# EAGLE board BeagleBone_Blue (EAGLE 8.0.1), part 1 of 3
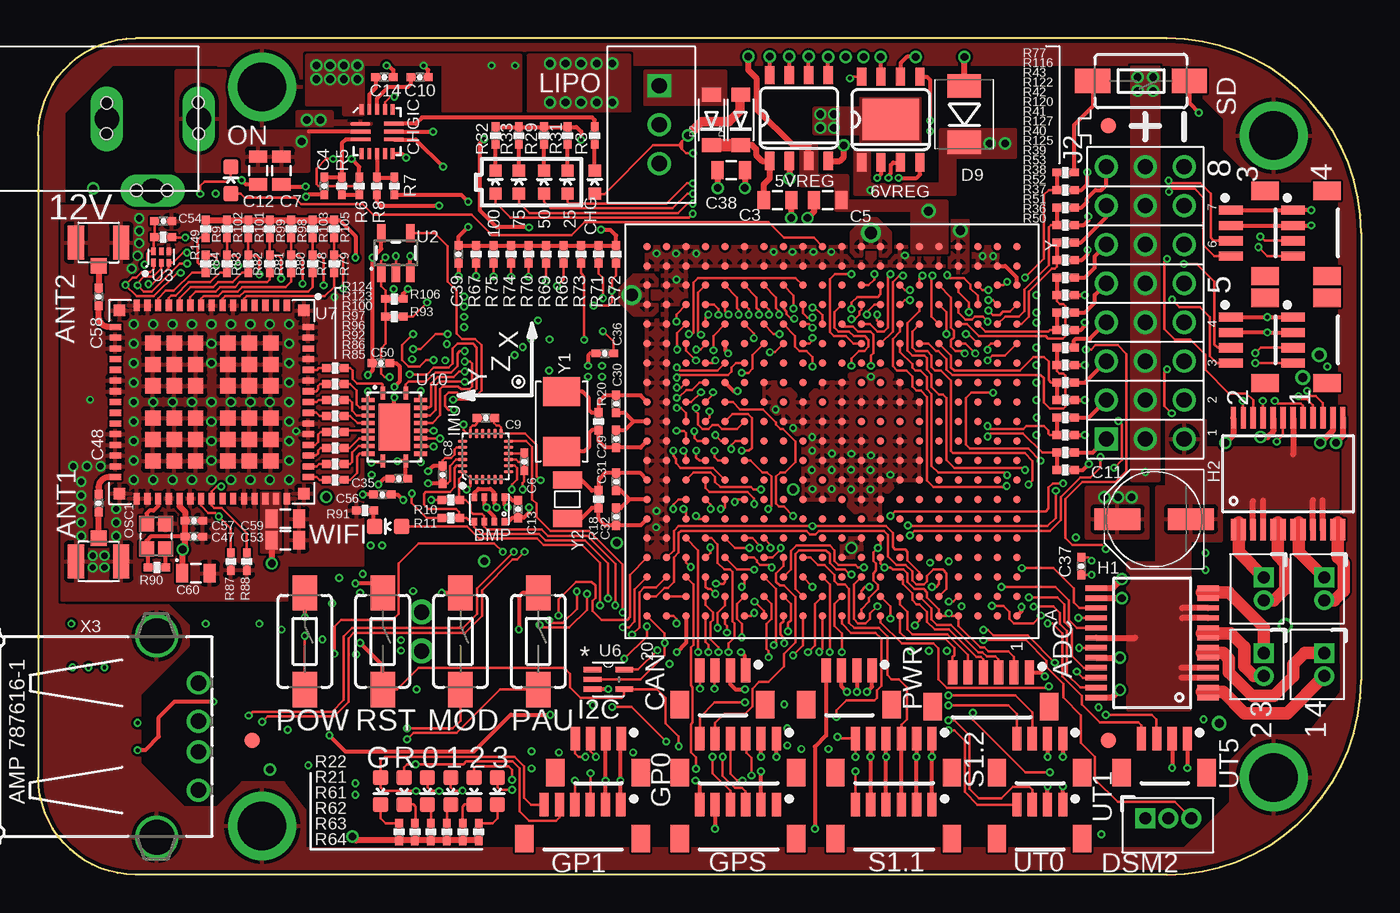
[diagram p5: board, top side]
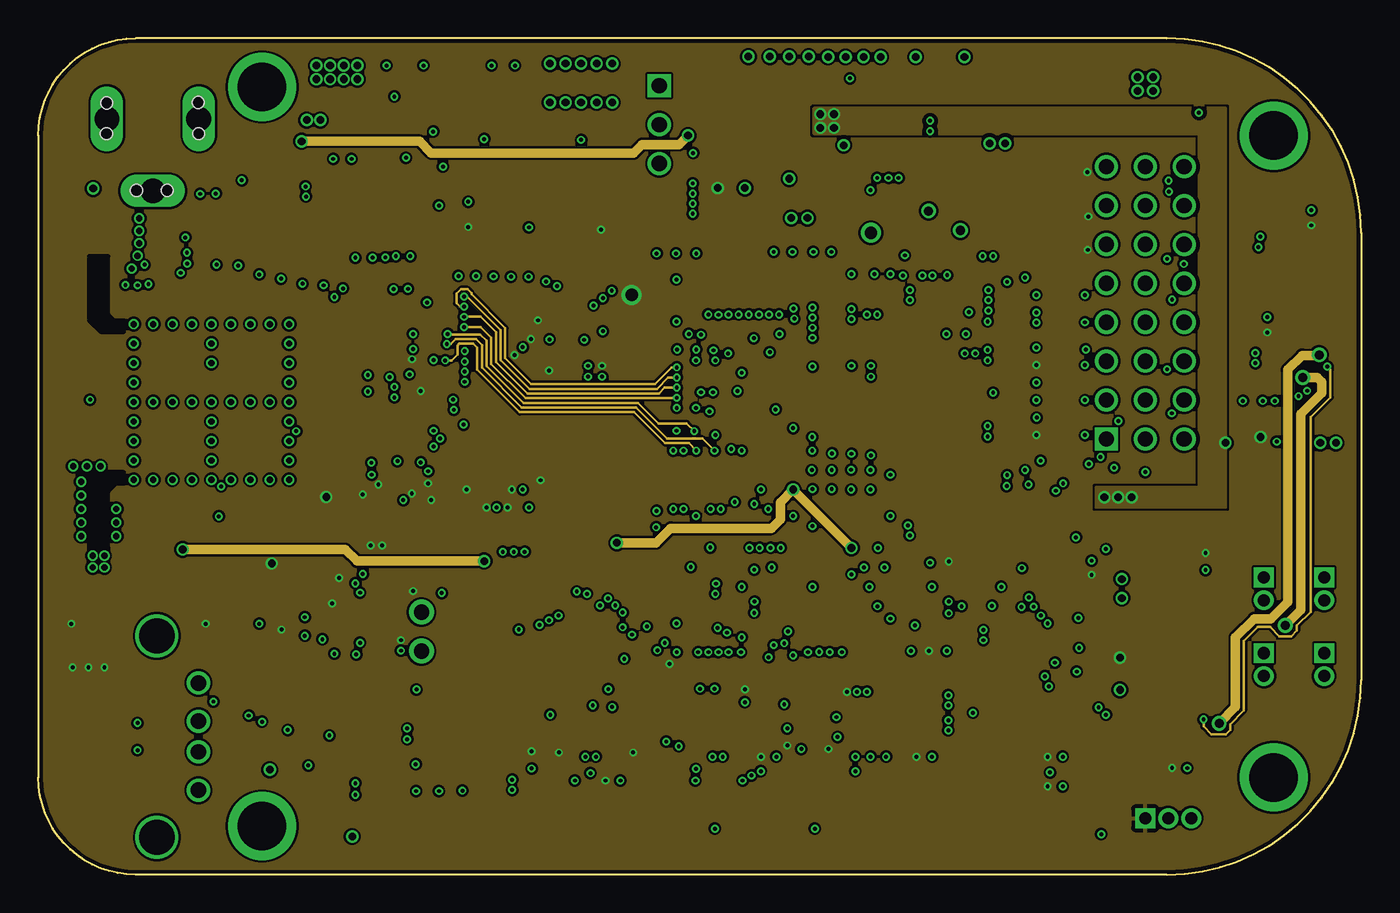
[diagram p6: board, inner layer Route2]
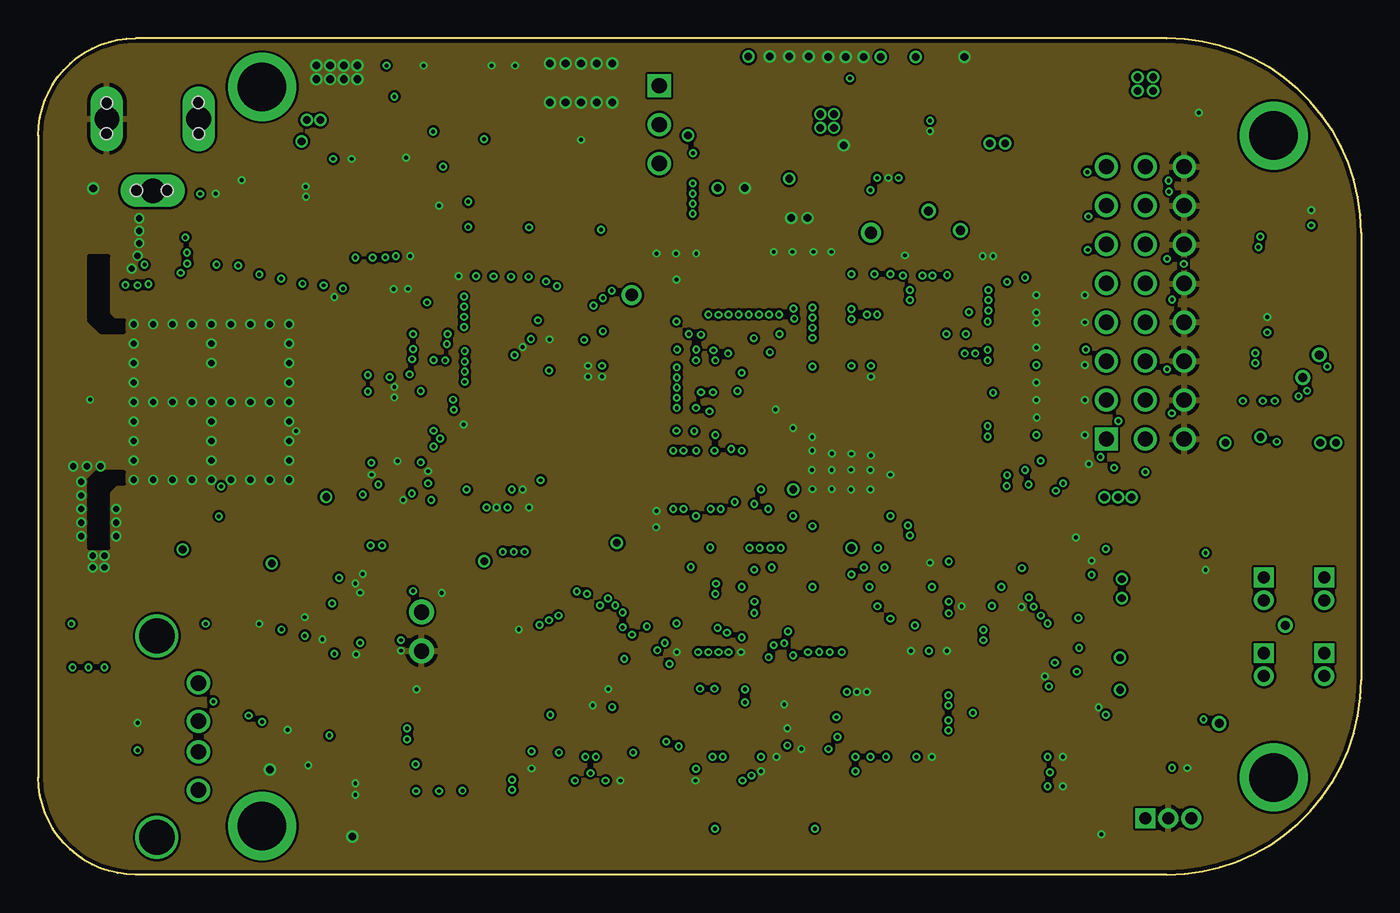
[diagram p7: board, inner layer Route15]
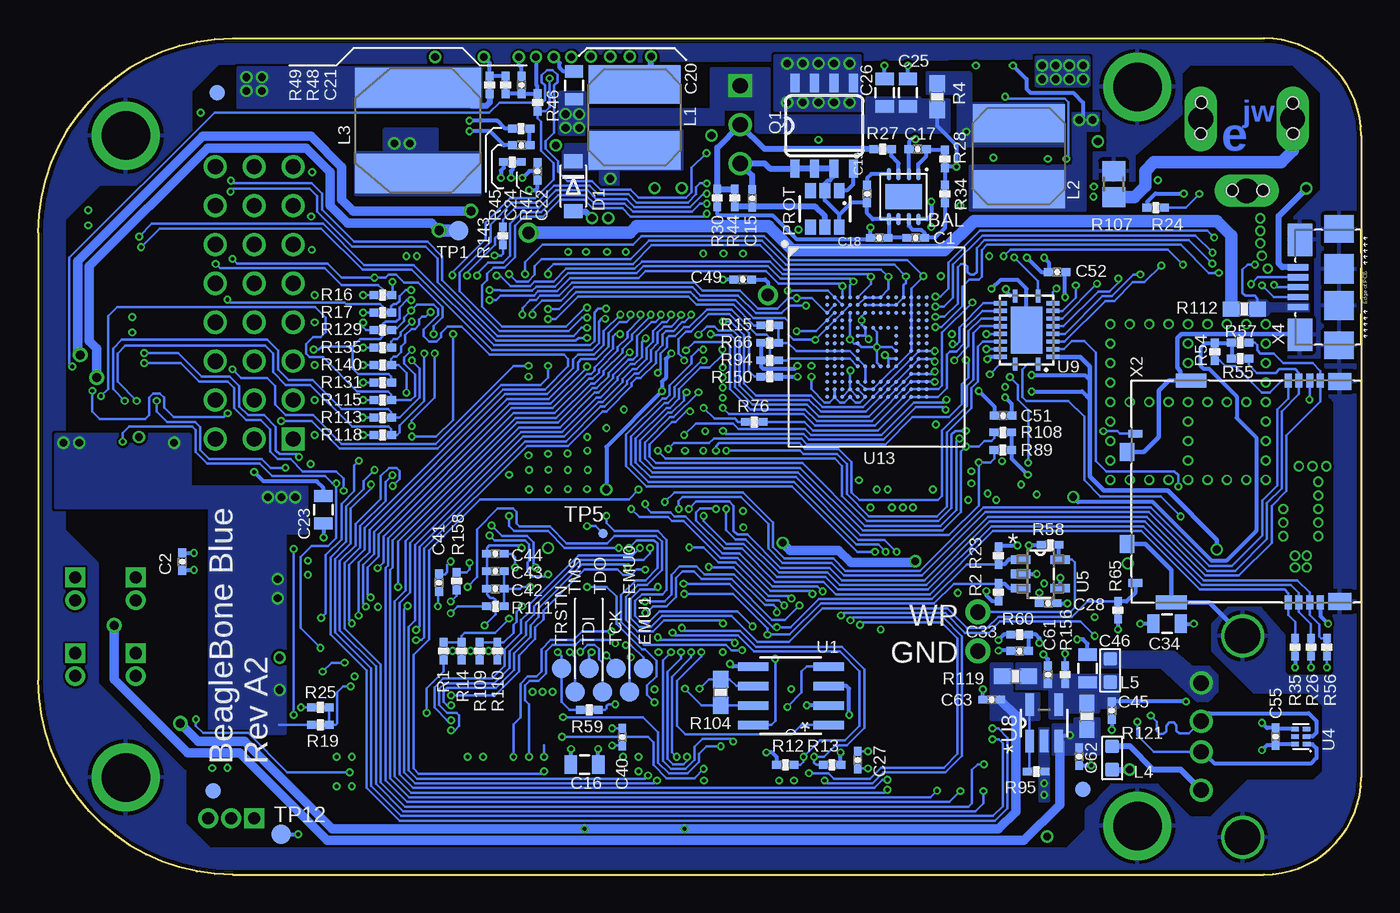
[diagram p8: board, bottom side, seen from below]

Size 86.36 x 54.61 mm. Coordinates in mm from the lower left corner, seen from the top.
Copper layers (1+2*15+16): Top 0.0178mm / dielectric 12mil / Route2 0.0356mm / dielectric 28mil / Route15 0.0356mm / dielectric 12mil / Bottom 0.0178mm
Design rules "SSC-EAGLE-4Lyr_v1.0.0.3 *": minimum track width 6mil, minimum drill 10mil, track to track 6mil, track to pad 6mil, pad to pad 6mil, via to via 6mil, smd to smd 6mil, copper to edge 10mil, drill to drill 8mil, minimum pad ring 10mil, minimum via ring 5mil, stop-mask expansion 3mil, vias tented up to drill 40mil, thermal gap 10mil
Net classes: 0 default: width 0.152 mm, drill 0.254 mm, clearance 0.152 mm; 1 ground: width 0.152 mm, drill 0.254 mm, clearance 0.152 mm; 2 usb: width 0.152 mm, drill 0.254 mm, clearance 0.152 mm; 3 power: width 0.152 mm, drill 0.254 mm, clearance 0.152 mm

## Footprints (pad centres in the part's own frame; a part is rotated, then mirrored left to right if it is on the bottom)
BEAGLEBONE_BLUE_LED-0603 = smd 1 x 1: A 0,-0.877; C 0,0.877
BEAGLEBONE_BLUE_SO08-TIGHT = smd 0.6 x 1.2: 1 -1.905,-2.8; 2 -0.635,-2.8; 3 0.635,-2.8; 4 1.905,-2.8; 5 1.905,2.8; 6 0.635,2.8; 7 -0.635,2.8; 8 -1.905,2.8
SO08-EXPOSED = smd 0.6 x 1.2: 1 -1.905,-2.8; 2 -0.635,-2.8; 3 0.635,-2.8; 4 1.905,-2.8; 5 1.905,2.8; 6 0.635,2.8; 7 -0.635,2.8; 8 -1.905,2.8 | smd 3.683 x 2.718: 9 0,0
PJ-102B_POWER_CON = drill 1.6 long: IN -6,0; OUT 0,0; OUT_CON -3,4.7 | hole 0.762: 0,-1.041; 0.025,0.965; -5.994,0.965; -5.969,-1.067; -1.93,4.674; -3.937,4.674
JST_SH_6 = smd 0.6 x 1.55: 1 5,0; 2 4,0; 3 3,0; 4 2,0; 5 1,0; 6 0,0 | smd 1.2 x 1.8: P$1 -1.3,-2.225; P$2 6.3,-2.225
U.FL-R-SMT-1 = smd 1.05 x 2.2: GND1 -1.475,0; GND2 1.475,0 | smd 1.05 x 1: SIG 0,-1.525
LED-0603 = smd 0.8 x 0.8: A 0,-0.75; C 0,0.75
8-SON_3X3MM = smd 0.305 x 0.813: 1 -0.965,-1.473; 2 -0.33,-1.473; 3 0.33,-1.473; 4 0.965,-1.473; 5 0.965,1.473; 6 0.33,1.473; 7 -0.33,1.473 | smd 0.305 x 0.787: 8 -0.965,1.473 | smd 2.4 x 1.651: PAD 0,0
BMP280 = smd 0.5 x 0.35: 1 0.8,0.975; 2 0.8,0.325; 3 0.8,-0.325; 4 0.8,-0.975; 5 -0.8,-0.975; 6 -0.8,-0.325; 7 -0.8,0.325; 8 -0.8,0.975
0402-CAP = smd 0.61 x 0.508: 1 -0.559,0; 2 0.559,0
0805 = smd 0.8 x 1.2: 1 -0.9,0; 2 0.9,0
PANASONIC_D = smd 3 x 1.4: + 2.4,0; - -2.4,0
JST_SH_4_SMD = smd 0.6 x 1.55: 1 0.46,1.27; 2 -0.54,1.27; 3 -1.54,1.27; 4 -2.54,1.27 | smd 1.2 x 1.8: P$1 -3.84,-0.955; P$2 1.728,-0.955
MP2615 = smd 1.295 x 0.254: 1 -1.092,0.508; 2 -1.092,0; 3 -1.092,-0.508; 9 1.092,-0.508; 10 1.092,0; 11 1.092,0.508 | smd 0.254 x 0.711: 4 -1.016,-1.448; 5 -0.508,-1.448; 6 0,-1.448; 7 0.508,-1.448; 8 1.016,-1.448; 12 1.016,1.448; 13 0.508,1.448; 14 0,1.448; 15 -0.508,1.448; 16 -1.016,1.448
ADAFRUIT_SOD-123FL = smd 0.91 x 1.22: A 1.637,0; C -1.637,0
DO-214AA = smd 1.524 x 2.184: A 1.841,0; C -1.841,0
JST_ZH_3 = drill 0.787 square: P$1 0,0 | drill 0.787: P$2 1.499,0; P$3 2.997,0
B1,27 = smd 1.27 x 1.27: TP 0,0
FIDUCIAL_40MIL = smd 1.016 x 1.016: P$1 0,0
GHI2_TESTPAD/W_HOLE_1X1 = drill 1 pad 1.626: P$1 0,0
SSOP24 = smd 0.348 x 1.397: 1 -3.575,-3.656; 2 -2.925,-3.656; 3 -2.275,-3.656; 4 -1.625,-3.656; 5 -0.975,-3.656; 6 -0.325,-3.656; 7 0.325,-3.656; 8 0.975,-3.656; 9 1.625,-3.656; 10 2.275,-3.656; 11 2.925,-3.656; 12 3.575,-3.656; 13 3.575,3.656; 14 2.925,3.656; 15 2.275,3.656; 16 1.625,3.656; 17 0.975,3.656; 18 0.325,3.656; 19 -0.325,3.656; 20 -0.975,3.656; 21 -1.625,3.656; 22 -2.275,3.656; 23 -2.925,3.656; 24 -3.575,3.656
QFN24G-0.4-3X3MM = smd 0.6 x 0.2: 1 -1.5,1; 2 -1.5,0.6; 3 -1.5,0.2; 4 -1.5,-0.2; 5 -1.5,-0.6; 6 -1.5,-1; 13 1.5,-1; 14 1.5,-0.6; 15 1.5,-0.2; 16 1.5,0.2; 17 1.5,0.6; 18 1.5,1 | smd 0.2 x 0.6: 7 -1,-1.5; 8 -0.6,-1.5; 9 -0.2,-1.5; 10 0.2,-1.5; 11 0.6,-1.5; 12 1,-1.5; 19 1,1.5; 20 0.6,1.5; 21 0.2,1.5; 22 -0.2,1.5; 23 -0.6,1.5; 24 -1,1.5
STRAWSON_EAGLE_LIB_3X8_0.1"_HEADER = drill 1 square: P$1 -2.54,-17.78 | drill 1: P$2 -2.54,-15.24; P$3 -2.54,-12.7; P$4 -2.54,-10.16; P$5 -2.54,-7.62; P$6 -2.54,-5.08; P$7 0,-17.78; P$8 0,-15.24; P$9 0,-12.7; P$10 0,-10.16; P$11 0,-7.62; P$12 0,-5.08; P$13 2.54,-17.78; P$14 2.54,-15.24; P$15 2.54,-12.7; P$16 2.54,-10.16; P$17 2.54,-7.62; P$18 2.54,-5.08; P$19 -2.54,-2.54; P$20 -2.54,0; P$21 0,-2.54; P$22 0,0; P$23 2.54,-2.54; P$24 2.54,0
SRN6045 = smd 2.5 x 6: 1 -2.175,-0.175; 2 2.125,-0.175
8X8MM_INDUCTOR = smd 2.591 x 8.204: 1 -2.794,0; 2 2.794,0
L0603 = smd 0.889 x 0.889: 1 -0.762,0; 2 0.762,0
JST_XH_3-PIN = drill 1 square: P$1 0,0 | drill 1: P$2 0,-2.54; P$3 0,-5.08
JST_ZH_2 = drill 0.787 pad 1.219 square: P$1 -0.749,0 | drill 0.787 pad 1.219: P$2 0.749,0
MOUNTING_HOLE = drill 3.175 pad 4.445: P$1 0,0
TACTILE-SWITCH-1101NE = smd 2.3 x 1.6: 1 -3.15,0; 2 3.15,0
NZ2520S = smd 1 x 1: 1 -0.825,-0.625; 2 0.825,-0.625; 3 0.825,0.625; 4 -0.825,0.625
SOT-236 = smd 0.991 x 0.711: 1 -1.194,0.94; 2 -1.194,0; 3 -1.194,-0.94; 4 1.194,-0.94; 5 1.194,0; 6 1.194,0.94
SO08-TIGHT = smd 0.6 x 1.2: 1 -1.905,-2.8; 2 -0.635,-2.8; 3 0.635,-2.8; 4 1.905,-2.8; 5 1.905,2.8; 6 0.635,2.8; 7 -0.635,2.8; 8 -1.905,2.8
0402-RES = smd 0.61 x 0.508: 1 -0.559,0; 2 0.559,0
0603-RES = smd 1.1 x 1: 1 -0.85,0; 2 0.85,0
R0805 = smd 1.3 x 1.5: 1 -0.85,0; 2 0.85,0
BEAGLEBONE_BLUE_OSD3358 = smd 0.5 x 0.5: A1 -12.065,-12.065; A2 -12.065,-10.795; A3 -12.065,-9.525; A4 -12.065,-8.255; A5 -12.065,-6.985; A6 -12.065,-5.715; A7 -12.065,-4.445; A8 -12.065,-3.175; A9 -12.065,-1.905; A10 -12.065,-0.635; A11 -12.065,0.635; A12 -12.065,1.905; A13 -12.065,3.175; A14 -12.065,4.445; A15 -12.065,5.715; A16 -12.065,6.985; A17 -12.065,8.255; A18 -12.065,9.525; A19 -12.065,10.795; A20 -12.065,12.065; B1 -10.795,-12.065; B2 -10.795,-10.795; B3 -10.795,-9.525; B4 -10.795,-8.255; B5 -10.795,-6.985; B6 -10.795,-5.715; B7 -10.795,-4.445; B8 -10.795,-3.175; B9 -10.795,-1.905; B10 -10.795,-0.635; B11 -10.795,0.635; B12 -10.795,1.905; B13 -10.795,3.175; B14 -10.795,4.445; B15 -10.795,5.715; B16 -10.795,6.985; B17 -10.795,8.255; B18 -10.795,9.525; B19 -10.795,10.795; B20 -10.795,12.065; C1 -9.525,-12.065; C2 -9.525,-10.795; C3 -9.525,-9.525; C4 -9.525,-8.255; C5 -9.525,-6.985; C6 -9.525,-5.715; C7 -9.525,-4.445; C8 -9.525,-3.175; C9 -9.525,-1.905; C10 -9.525,-0.635; C11 -9.525,0.635; C12 -9.525,1.905; C13 -9.525,3.175; C14 -9.525,4.445; C15 -9.525,5.715; C16 -9.525,6.985; C17 -9.525,8.255; C18 -9.525,9.525; C19 -9.525,10.795; C20 -9.525,12.065; D1 -8.255,-12.065; D2 -8.255,-10.795; D3 -8.255,-9.525; D4 -8.255,-8.255; D5 -8.255,-6.985; D6 -8.255,-5.715; D7 -8.255,-4.445; D8 -8.255,-3.175; D9 -8.255,-1.905; D10 -8.255,-0.635; D11 -8.255,0.635; D12 -8.255,1.905; D13 -8.255,3.175; D14 -8.255,4.445; D15 -8.255,5.715; D16 -8.255,6.985; D17 -8.255,8.255; D18 -8.255,9.525; D19 -8.255,10.795; D20 -8.255,12.065; E1 -6.985,-12.065; E2 -6.985,-10.795; E3 -6.985,-9.525; E4 -6.985,-8.255; E5 -6.985,-6.985; E6 -6.985,-5.715; E7 -6.985,-4.445; E8 -6.985,-3.175; E9 -6.985,-1.905; E10 -6.985,-0.635; E11 -6.985,0.635; E12 -6.985,1.905; E13 -6.985,3.175; E14 -6.985,4.445; E15 -6.985,5.715; E16 -6.985,6.985; E17 -6.985,8.255; E18 -6.985,9.525; E19 -6.985,10.795; E20 -6.985,12.065; F1 -5.715,-12.065; F2 -5.715,-10.795; F3 -5.715,-9.525; F4 -5.715,-8.255; F5 -5.715,-6.985; F6 -5.715,-5.715; F7 -5.715,-4.445; F8 -5.715,-3.175; F9 -5.715,-1.905; F10 -5.715,-0.635; F11 -5.715,0.635; F12 -5.715,1.905; F13 -5.715,3.175; F14 -5.715,4.445; F15 -5.715,5.715; F16 -5.715,6.985; F17 -5.715,8.255; F18 -5.715,9.525; F19 -5.715,10.795; F20 -5.715,12.065; G1 -4.445,-12.065; G2 -4.445,-10.795; G3 -4.445,-9.525; G4 -4.445,-8.255; G5 -4.445,-6.985; G6 -4.445,-5.715; G7 -4.445,-4.445; G8 -4.445,-3.175; G9 -4.445,-1.905; G10 -4.445,-0.635; G11 -4.445,0.635; G12 -4.445,1.905; G13 -4.445,3.175; G14 -4.445,4.445; G15 -4.445,5.715; G16 -4.445,6.985; G17 -4.445,8.255; G18 -4.445,9.525; G19 -4.445,10.795; G20 -4.445,12.065; H1 -3.175,-12.065; H2 -3.175,-10.795; H3 -3.175,-9.525; H4 -3.175,-8.255; H5 -3.175,-6.985; H6 -3.175,-5.715; H7 -3.175,-4.445; H8 -3.175,-3.175; H9 -3.175,-1.905; H10 -3.175,-0.635; H11 -3.175,0.635; H12 -3.175,1.905; H13 -3.175,3.175; H14 -3.175,4.445; H15 -3.175,5.715; H16 -3.175,6.985; H17 -3.175,8.255; H18 -3.175,9.525; H19 -3.175,10.795; H20 -3.175,12.065; J1 -1.905,-12.065; J2 -1.905,-10.795; J3 -1.905,-9.525; J4 -1.905,-8.255; J5 -1.905,-6.985; J6 -1.905,-5.715; J7 -1.905,-4.445; J8 -1.905,-3.175; J9 -1.905,-1.905; J10 -1.905,-0.635; J11 -1.905,0.635; J12 -1.905,1.905; J13 -1.905,3.175; J14 -1.905,4.445; J15 -1.905,5.715; J16 -1.905,6.985; J17 -1.905,8.255; J18 -1.905,9.525; J19 -1.905,10.795; J20 -1.905,12.065; K1 -0.635,-12.065; K2 -0.635,-10.795; K3 -0.635,-9.525; K4 -0.635,-8.255; K5 -0.635,-6.985; K6 -0.635,-5.715; K7 -0.635,-4.445; K8 -0.635,-3.175; K9 -0.635,-1.905; K10 -0.635,-0.635; K11 -0.635,0.635; K12 -0.635,1.905; K13 -0.635,3.175; K14 -0.635,4.445; K15 -0.635,5.715; K16 -0.635,6.985; K17 -0.635,8.255; K18 -0.635,9.525; K19 -0.635,10.795; K20 -0.635,12.065; L1 0.635,-12.065; L2 0.635,-10.795; L3 0.635,-9.525; L4 0.635,-8.255; L5 0.635,-6.985; L6 0.635,-5.715; L7 0.635,-4.445; L8 0.635,-3.175; L9 0.635,-1.905; L10 0.635,-0.635; L11 0.635,0.635; L12 0.635,1.905; L13 0.635,3.175; L14 0.635,4.445; L15 0.635,5.715; L16 0.635,6.985; L17 0.635,8.255; L18 0.635,9.525; L19 0.635,10.795; L20 0.635,12.065; M1 1.905,-12.065; M2 1.905,-10.795; M3 1.905,-9.525; M4 1.905,-8.255; M5 1.905,-6.985; M6 1.905,-5.715; M7 1.905,-4.445; M8 1.905,-3.175; M9 1.905,-1.905; M10 1.905,-0.635; M11 1.905,0.635; M12 1.905,1.905; M13 1.905,3.175; M14 1.905,4.445; M15 1.905,5.715; M16 1.905,6.985; M17 1.905,8.255; M18 1.905,9.525; M19 1.905,10.795; M20 1.905,12.065; N1 3.175,-12.065; N2 3.175,-10.795; N3 3.175,-9.525; N4 3.175,-8.255; N5 3.175,-6.985; N6 3.175,-5.715; N7 3.175,-4.445; N8 3.175,-3.175; N9 3.175,-1.905; N10 3.175,-0.635; N11 3.175,0.635; N12 3.175,1.905; N13 3.175,3.175; N14 3.175,4.445; N15 3.175,5.715; N16 3.175,6.985; N17 3.175,8.255; N18 3.175,9.525; N19 3.175,10.795; N20 3.175,12.065; P1 4.445,-12.065; P2 4.445,-10.795; P3 4.445,-9.525; P4 4.445,-8.255; P5 4.445,-6.985; P6 4.445,-5.715; P7 4.445,-4.445; P8 4.445,-3.175; P9 4.445,-1.905; P10 4.445,-0.635; P11 4.445,0.635; P12 4.445,1.905; P13 4.445,3.175; P14 4.445,4.445; P15 4.445,5.715; P16 4.445,6.985; P17 4.445,8.255; P18 4.445,9.525; P19 4.445,10.795; P20 4.445,12.065; R1 5.715,-12.065; R2 5.715,-10.795; R3 5.715,-9.525; R4 5.715,-8.255; R5 5.715,-6.985; R6 5.715,-5.715; R7 5.715,-4.445; R8 5.715,-3.175; R9 5.715,-1.905; R10 5.715,-0.635; R11 5.715,0.635; R12 5.715,1.905; R13 5.715,3.175; R14 5.715,4.445; R15 5.715,5.715; R16 5.715,6.985; R17 5.715,8.255; R18 5.715,9.525; R19 5.715,10.795; R20 5.715,12.065; T1 6.985,-12.065; T2 6.985,-10.795; T3 6.985,-9.525; T4 6.985,-8.255; T5 6.985,-6.985; T6 6.985,-5.715; T7 6.985,-4.445; T8 6.985,-3.175; T9 6.985,-1.905; T10 6.985,-0.635; T11 6.985,0.635; T12 6.985,1.905; T13 6.985,3.175; T14 6.985,4.445; T15 6.985,5.715; T16 6.985,6.985; T17 6.985,8.255; T18 6.985,9.525; T19 6.985,10.795; T20 6.985,12.065; U1 8.255,-12.065; U2 8.255,-10.795; U3 8.255,-9.525; U4 8.255,-8.255; U5 8.255,-6.985; U6 8.255,-5.715; U7 8.255,-4.445; U8 8.255,-3.175; U9 8.255,-1.905; U10 8.255,-0.635; U11 8.255,0.635; U12 8.255,1.905; U13 8.255,3.175; U14 8.255,4.445; U15 8.255,5.715; U16 8.255,6.985; U17 8.255,8.255; U18 8.255,9.525; U19 8.255,10.795; U20 8.255,12.065; V1 9.525,-12.065; V2 9.525,-10.795; V3 9.525,-9.525; V4 9.525,-8.255; V5 9.525,-6.985; V6 9.525,-5.715; V7 9.525,-4.445; V8 9.525,-3.175; V9 9.525,-1.905; V10 9.525,-0.635; V11 9.525,0.635; V12 9.525,1.905; V13 9.525,3.175; V14 9.525,4.445; V15 9.525,5.715; V16 9.525,6.985; V17 9.525,8.255; V18 9.525,9.525; V19 9.525,10.795; V20 9.525,12.065; W1 10.795,-12.065; W2 10.795,-10.795; W3 10.795,-9.525; W4 10.795,-8.255; W5 10.795,-6.985; W6 10.795,-5.715; W7 10.795,-4.445; W8 10.795,-3.175; W9 10.795,-1.905; W10 10.795,-0.635; W11 10.795,0.635; W12 10.795,1.905; W13 10.795,3.175; W14 10.795,4.445; W15 10.795,5.715; W16 10.795,6.985; W17 10.795,8.255; W18 10.795,9.525; W19 10.795,10.795; W20 10.795,12.065; Y1 12.065,-12.065; Y2 12.065,-10.795; Y3 12.065,-9.525; Y4 12.065,-8.255; Y5 12.065,-6.985; Y6 12.065,-5.715; Y7 12.065,-4.445; Y8 12.065,-3.175; Y9 12.065,-1.905; Y10 12.065,-0.635; Y11 12.065,0.635; Y12 12.065,1.905; Y13 12.065,3.175; Y14 12.065,4.445; Y15 12.065,5.715; Y16 12.065,6.985; Y17 12.065,8.255; Y18 12.065,9.525; Y19 12.065,10.795; Y20 12.065,12.065
BEAGLEBONE_BLUE_B0,65 = smd 0.635 x 0.635: TP 0,0
BEAGLEBONE_BLUE_D8 = smd 1.981 x 0.559: 1 -2.464,1.905; 2 -2.464,0.635; 3 -2.464,-0.635; 4 -2.464,-1.905; 5 2.464,-1.905; 6 2.464,-0.635; 7 2.464,0.635; 8 2.464,1.905
BEAGLEBONE_BLUE_SOT23-5 = smd 0.55 x 1.2: 1 -0.95,-1.3; 2 0,-1.3; 3 0.95,-1.3; 4 0.95,1.3; 5 -0.95,1.3
SON-6(TI)-DRY = smd 0.3 x 0.52: 1 -0.5,-0.38 | smd 0.3 x 0.49: 2 0,-0.375; 3 0.5,-0.375; 4 0.5,0.375; 5 0,0.375; 6 -0.5,0.375
SOT95P290X145-5N = smd 1.27 x 0.559: 1 -1.295,0.94; 2 -1.295,0; 3 -1.295,-0.94; 4 1.295,-0.94; 5 1.295,0.94
BEAGLEBONE_BLUE_DCK5 = smd 1.168 x 0.356: 1 -1.041,0.65; 2 -1.041,0; 3 -1.041,-0.65; 4 1.041,-0.65; 5 1.041,0.65
MOC-100(TI) = smd 0.75 x 0.75: 1 -6.025,-5.975; 17 6.025,-5.975; 33 6.025,5.975; 49 -6.025,5.975 | smd 0.4 x 0.75: 2 -4.9,-6.3; 3 -4.2,-6.3; 4 -3.5,-6.3; 5 -2.8,-6.3; 6 -2.1,-6.3; 7 -1.4,-6.3; 8 -0.7,-6.3; 9 0,-6.3; 10 0.7,-6.3; 11 1.4,-6.3; 12 2.1,-6.3; 13 2.8,-6.3; 14 3.5,-6.3; 15 4.2,-6.3; 16 4.9,-6.3; 34 4.9,6.3; 35 4.2,6.3; 36 3.5,6.3; 37 2.8,6.3; 38 2.1,6.3; 39 1.4,6.3; 40 0.7,6.3; 41 0,6.3; 42 -0.7,6.3; 43 -1.4,6.3; 44 -2.1,6.3; 45 -2.8,6.3; 46 -3.5,6.3; 47 -4.2,6.3; 48 -4.9,6.3 | smd 0.75 x 0.4: 18 6.3,-4.9; 19 6.3,-4.2; 20 6.3,-3.5; 21 6.3,-2.8; 22 6.3,-2.1; 23 6.3,-1.4; 24 6.3,-0.7; 25 6.3,0; 26 6.3,0.7; 27 6.3,1.4; 28 6.3,2.1; 29 6.3,2.8; 30 6.3,3.5; 31 6.3,4.2; 32 6.3,4.9; 50 -6.3,4.9; 51 -6.3,4.2; 52 -6.3,3.5; 53 -6.3,2.8; 54 -6.3,2.1; 55 -6.3,1.4; 56 -6.3,0.7; 57 -6.3,0; 58 -6.3,-0.7; 59 -6.3,-1.4; 60 -6.3,-2.1; 61 -6.3,-2.8; 62 -6.3,-3.5; 63 -6.3,-4.2; 64 -6.3,-4.9 | smd 1 x 1: G1 -3.85,-3.85; G2 -2.45,-3.85; G3 -1.05,-3.85; G4 1.05,-3.85; G5 2.45,-3.85; G6 3.85,-3.85; G7 -3.85,-2.45; G8 -2.45,-2.45; G9 -1.05,-2.45; G10 1.05,-2.45; G11 2.45,-2.45; G12 3.85,-2.45; G13 -3.85,-1.05; G14 -2.45,-1.05; G15 -1.05,-1.05; G16 1.05,-1.05; G17 2.45,-1.05; G18 3.85,-1.05; G19 -3.85,1.05; G20 -2.45,1.05; G21 -1.05,1.05; G22 1.05,1.05; G23 2.45,1.05; G24 3.85,1.05; G25 -3.85,2.45; G26 -2.45,2.45; G27 -1.05,2.45; G28 1.05,2.45; G29 2.45,2.45; G30 3.85,2.45; G31 -3.85,3.85; G32 -2.45,3.85; G33 -1.05,3.85; G34 1.05,3.85; G35 2.45,3.85; G36 3.85,3.85
DBV5 = smd 1.473 x 0.559: 1 -1.194,0.95; 2 -1.194,0; 3 -1.194,-0.95; 4 1.194,-0.95; 5 1.194,0.95
R-PVQFN-N20(TI) = smd 0.85 x 0.28: 1 -2.225,-0.75; 10 2.225,-0.75; 11 2.225,0.75; 20 -2.225,0.75 | smd 0.28 x 0.85: 2 -1.75,-1.725; 3 -1.25,-1.725; 4 -0.75,-1.725; 5 -0.25,-1.725; 6 0.25,-1.725; 7 0.75,-1.725; 8 1.25,-1.725; 9 1.75,-1.725; 12 1.75,1.725; 13 1.25,1.725; 14 0.75,1.725; 15 0.25,1.725; 16 -0.25,1.725; 17 -0.75,1.725; 18 -1.25,1.725; 19 -1.75,1.725 | smd 3.05 x 2.05: TP 0,0
MICRON_EMMC_153 = smd 0.245 x 0.245: A1 -3.25,3.25; A2 -2.75,3.25; A3 -2.25,3.25; A4 -1.75,3.25; A5 -1.25,3.25; A6 -0.75,3.25; A7 -0.25,3.25; A8 0.25,3.25; A9 0.75,3.25; A10 1.25,3.25; A11 1.75,3.25; A12 2.25,3.25; A13 2.75,3.25; A14 3.25,3.25; B1 -3.25,2.75; B2 -2.75,2.75; B3 -2.25,2.75; B4 -1.75,2.75; B5 -1.25,2.75; B6 -0.75,2.75; B7 -0.25,2.75; B8 0.25,2.75; B9 0.75,2.75; B10 1.25,2.75; B11 1.75,2.75; B12 2.25,2.75; B13 2.75,2.75; B14 3.25,2.75; C1 -3.25,2.25; C2 -2.75,2.25; C3 -2.25,2.25; C4 -1.75,2.25; C5 -1.25,2.25; C6 -0.75,2.25; C7 -0.25,2.25; C8 0.25,2.25; C9 0.75,2.25; C10 1.25,2.25; C11 1.75,2.25; C12 2.25,2.25; C13 2.75,2.25; C14 3.25,2.25; D1 -3.25,1.75; D2 -2.75,1.75; D3 -2.25,1.75; D4 -1.75,1.75; D12 2.25,1.75; D13 2.75,1.75; D14 3.25,1.75; E1 -3.25,1.25; E2 -2.75,1.25; E3 -2.25,1.25; E5 -1.25,1.25; E6 -0.75,1.25; E7 -0.25,1.25; E8 0.25,1.25; E9 0.75,1.25; E10 1.25,1.25; E12 2.25,1.25; E13 2.75,1.25; E14 3.25,1.25; F1 -3.25,0.75; F2 -2.75,0.75; F3 -2.25,0.75; F5 -1.25,0.75; F10 1.25,0.75; F12 2.25,0.75; F13 2.75,0.75; F14 3.25,0.75; G1 -3.25,0.25; G2 -2.75,0.25; G3 -2.25,0.25; G5 -1.25,0.25; G10 1.25,0.25; G12 2.25,0.25; G13 2.75,0.25; G14 3.25,0.25; H1 -3.25,-0.25; H2 -2.75,-0.25; H3 -2.25,-0.25; H5 -1.25,-0.25; H10 1.25,-0.25; H12 2.25,-0.25; H13 2.75,-0.25; H14 3.25,-0.25; J1 -3.25,-0.75; J2 -2.75,-0.75; J3 -2.25,-0.75; J5 -1.25,-0.75; J10 1.25,-0.75; J12 2.25,-0.75; J13 2.75,-0.75; J14 3.25,-0.75; K1 -3.25,-1.25; K2 -2.75,-1.25; K3 -2.25,-1.25; K5 -1.25,-1.25; K6 -0.75,-1.25; K7 -0.25,-1.25; K8 0.25,-1.25; K9 0.75,-1.25; K10 1.25,-1.25; K12 2.25,-1.25; K13 2.75,-1.25; K14 3.25,-1.25; L1 -3.25,-1.75; L2 -2.75,-1.75; L3 -2.25,-1.75; L12 2.25,-1.75; L13 2.75,-1.75; L14 3.25,-1.75; M1 -3.25,-2.25; M2 -2.75,-2.25; M3 -2.25,-2.25; M4 -1.75,-2.25; M5 -1.25,-2.25; M6 -0.75,-2.25; M7 -0.25,-2.25; M8 0.25,-2.25; M9 0.75,-2.25; M10 1.25,-2.25; M11 1.75,-2.25; M12 2.25,-2.25; M13 2.75,-2.25; M14 3.25,-2.25; N1 -3.25,-2.75; N2 -2.75,-2.75; N3 -2.25,-2.75; N4 -1.75,-2.75; N5 -1.25,-2.75; N6 -0.75,-2.75; N7 -0.25,-2.75; N8 0.25,-2.75; N9 0.75,-2.75; N10 1.25,-2.75; N11 1.75,-2.75; N12 2.25,-2.75; N13 2.75,-2.75; N14 3.25,-2.75; P1 -3.25,-3.25; P2 -2.75,-3.25; P3 -2.25,-3.25; P4 -1.75,-3.25; P5 -1.25,-3.25; P6 -0.75,-3.25; P7 -0.25,-3.25; P8 0.25,-3.25; P9 0.75,-3.25; P10 1.25,-3.25; P11 1.75,-3.25; P12 2.25,-3.25; P13 2.75,-3.25; P14 3.25,-3.25
SCHA5B0200 = smd 0.9 x 0.45: 1 -7.25,3.365; 2 -7.25,2.665; 3 -7.25,1.965; 4 -7.25,1.265; 5 7.25,1.265; 6 7.25,1.965; 7 7.25,2.665; 8 7.25,3.365 | smd 0.5 x 0.9: CD -5.975,13.35; GND 3.775,13.35 | smd 0.9 x 2: CGND1 -7.25,11; CGND4 7.25,9.7 | smd 1.1 x 1.5: CGND2 -7.188,0; CGND3 7.188,0 | smd 1.2 x 0.95: CGND5 2.575,13.9; CGND6 -3.425,13.9
USB_HOST_HORIZONTAL_W/CHASSIS_GND = drill 1: 1 -3.5,12.99; 2 -1,12.99; 3 1,12.99; 4 3.5,12.99 | drill 2.3: 5 -6.57,10.28; 6 6.57,10.28
10118192-0001LF(MICRO-USB-B-AMPHENOL-FCI) = smd 1.8 x 1.9: CGND1 -3.8,0; CGND4 3.8,0 | smd 1.9 x 1.9: CGND2 -1.2,0; CGND3 1.2,0 | smd 2.1 x 1.6: CGND5 3.1,2.55; CGND6 -3.1,2.55 | smd 0.4 x 1.35: D+ 0,2.675; D- -0.65,2.675; GND 1.3,2.675; ID 0.65,2.675; VBUS -1.3,2.675
CRYSTAL_5X3.2MM = smd 1.9 x 2.4: 1 -1.95,0; 2 1.95,0
CRYSTAL_3.2X1.5 = smd 1.1 x 1.9: P$1 -1.25,0; P$2 1.25,0

## Placement (x,y rotation side)
0  BLUE  [BEAGLEBONE_BLUE_LED-0603]  25.4,5.46 180 top
1  BLUE  [BEAGLEBONE_BLUE_LED-0603]  26.92,5.46 180 top
2  BLUE  [BEAGLEBONE_BLUE_LED-0603]  28.45,5.46 180 top
3  BLUE  [BEAGLEBONE_BLUE_LED-0603]  29.97,5.46 180 top
5VREG  AP1509SOIC-8-TIGHT  [BEAGLEBONE_BLUE_SO08-TIGHT]  49.66,49.4 0 top
6VREG  AOZ1284  [SO08-EXPOSED]  55.65,49.3 0 top
12V  PJ-102B_POWER_CON  [PJ-102B_POWER_CON]  4.47,49.35 180 top
ADC  JST_SH_6  [JST_SH_6]  59.69,13.21 0 top
ANT1  U.FL-R-SMT-1(10)  [U.FL-R-SMT-1]  3.94,20.45 180 top
ANT2  U.FL-R-SMT-1(10)  [U.FL-R-SMT-1]  3.94,41.27 0 top
B0  RED  [LED-0603]  34.54,45.21 0 top
B1  GREEN  [LED-0603]  33.02,45.21 0 top
B2  GREEN  [LED-0603]  31.37,45.21 0 top
B3  GREEN  [LED-0603]  29.84,45.21 0 top
BAL  BQ29209  [8-SON_3X3MM]  29.87,44.27 180 bottom
BMP  BMP280  [BMP280]  29.44,23.85 270 top
BOARD  [BEAGLEBONE_BLUE_NO_HOLES]  0,54.61 270 top
C1  0.1uF  [0402-CAP]  29.08,41.58 180 bottom
C2  0.1uF  [0402-CAP]  76.96,20.45 90 bottom
C3  10uF  [0805]  48.26,44.04 0 top
C4  1uF  [0402-CAP]  18.67,44.96 90 top
C5  10uF  [0805]  51.54,44.04 180 top
C6  0.1uF  [0402-CAP]  31.72,26.95 270 top
C7  10uF  [0805]  15.88,45.97 270 top
C8  0.1uF  [0402-CAP]  26.39,26.11 90 top
C9  0.1uF  [0402-CAP]  29.21,29.82 0 top
C10  1uF  [0402-CAP]  24.89,52.07 180 top
C11  100uF 16V  [PANASONIC_D]  72.85,23.22 180 top
C12  10uF  [0805]  14.35,45.97 270 top
C13  0.1uF  [0402-CAP]  31.32,23.88 270 top
C14  0.1uF  [0402-CAP]  22.61,52.07 0 top
C15  0.1uF  [0402-CAP]  39.75,44.17 270 bottom
C16  10uF  [0805]  50.7,7.19 0 bottom
C17  0.1uF  [0402-CAP]  28.96,47.37 0 bottom
C18  0.1uF  [0402-CAP]  31.47,41.58 180 bottom
C19  0.1uF  [0402-CAP]  32.26,44.45 270 bottom
C20  10uF  [0805]  51.38,51.54 270 bottom
C21  0.1uF  [0402-CAP]  54.81,51.56 90 bottom
C22  0.1uF  [0402-CAP]  53.77,45.92 270 bottom
C23  10uF  [0805]  67.74,23.83 90 bottom
C24  0.1uF  [0402-CAP]  54.84,47.62 0 bottom
C25  10uF  [0805]  29.59,51.05 90 bottom
C26  10uF  [0805]  31.11,51.05 90 bottom
C27  0.1uF  [0402-CAP]  32.87,7.49 270 bottom
C28  0.1uF  [0402-CAP]  20.45,17.73 180 bottom
C29  10pF  [0402-CAP]  37.72,28.45 90 top
C30  10pF  [0402-CAP]  37.72,30.73 270 top
C31  10pF  [0402-CAP]  37.72,25.65 270 top
C32  10pF  [0402-CAP]  37.72,23.37 270 top
C33  2.2uF  [0402-CAP]  22.3,14.6 180 bottom
C34  10uF  [0805]  12.67,16.38 0 bottom
C35  0.1uF  [0402-CAP]  23.55,25.86 180 top
C36  2.2uF  [0402-CAP]  36.98,34.04 180 top
C37  0.1uF  [0402-CAP]  68.08,20.15 90 top
C38  10uF  [0805]  45.24,46 0 top
C39  0.1uF  [0402-CAP]  27.43,40.51 270 top
C40  0.1uF  [0402-CAP]  48.23,8.99 90 bottom
C41  0.1uF  [0402-CAP]  60.2,19.05 270 bottom
C42  1nF  [0402-CAP]  56.52,18.67 180 bottom
C43  0.1uF  [0402-CAP]  56.52,19.81 180 bottom
C44  0.1uF  [0402-CAP]  56.52,20.95 180 bottom
C45  0.1uF  [0402-CAP]  16.28,10.72 270 bottom
C46  10uF  [0805]  17.87,13.46 90 bottom
C47  0.1uF  [0402-CAP]  10.16,22.07 0 top
C48  10pF  [0402-CAP]  3.94,24.26 90 top
C49  0.1uF  [0402-CAP]  40.36,38.86 0 bottom
C50  0.1uF  [0402-CAP]  22.38,33.4 0 top
C51  0.1uF  [0402-CAP]  23.37,29.97 180 bottom
C52  0.1uF  [0402-CAP]  19.84,39.34 0 bottom
C53  10uF  [0805]  16.13,23.24 0 top
C54  0.1uF  [0402-CAP]  8.15,42.67 0 top
C55  0.1uF  [0402-CAP]  5.59,9.02 90 bottom
C56  0.1uF  [0402-CAP]  22.45,24.82 0 top
C57  1uF  [0402-CAP]  10.16,23.11 180 top
C58  10pF  [0402-CAP]  3.94,37.72 270 top
C59  10uF  [0805]  16.13,21.84 0 top
C60  10uF  [0805]  10.29,19.69 180 top
C61  1uF  [0402-CAP]  20.45,13.06 270 bottom
C62  0.22uF  [0402-CAP]  18.41,7.7 270 bottom
C63  0.22uF  [0402-CAP]  24.13,11.43 180 bottom
CAN  JST_SH_4  [JST_SH_4_SMD]  45.72,12.06 0 top
CHG  GRN  [LED-0603]  36.32,45.21 0 top
CHGIC  MP2615  [MP2615]  22.12,48.51 0 top
D1  [ADAFRUIT_SOD-123FL]  51.44,44.96 270 bottom
D2  [ADAFRUIT_SOD-123FL]  43.94,49.28 90 top
D3  [ADAFRUIT_SOD-123FL]  45.85,49.28 90 top
D9  [DO-214AA]  60.45,49.66 90 top
DSM2  JST_ZH_3  [JST_ZH_3]  72.26,3.68 0 top
E1  JST_SH_4  [JST_SH_4_SMD]  83.19,35.94 90 top
E2  JST_SH_4  [JST_SH_4_SMD]  79.12,35.94 90 top
E3  JST_SH_4  [JST_SH_4_SMD]  79.12,42.93 90 top
E4  JST_SH_4  [JST_SH_4_SMD]  83.19,42.93 90 top
EMU0  TPSQB1,27  [B1,27]  47.75,11.94 0 bottom
EMU1  TPSQB1,27  [B1,27]  46.86,13.46 0 bottom
FUD1  FIDUCIAL  [FIDUCIAL_40MIL]  13.97,8.76 0 top
FUD2  FIDUCIAL  [FIDUCIAL_40MIL]  69.85,8.76 0 top
FUD3  FIDUCIAL  [FIDUCIAL_40MIL]  69.85,48.89 0 top
FUD4  FIDUCIAL  [FIDUCIAL_40MIL]  74.93,5.46 0 bottom
FUD5  FIDUCIAL  [FIDUCIAL_40MIL]  74.68,51.05 0 bottom
FUD6  FIDUCIAL  [FIDUCIAL_40MIL]  18.16,5.59 0 bottom
G  GREEN  [BEAGLEBONE_BLUE_LED-0603]  22.35,5.46 180 top
GND  GHI2_TESTPAD/W_HOLE_1X1  [GHI2_TESTPAD/W_HOLE_1X1]  25.02,14.6 0 bottom
GP0  JST_SH_6  [JST_SH_6]  43.18,8.89 0 top
GP1  JST_SH_6  [JST_SH_6]  33.02,4.57 0 top
GPS  JST_SH_6  [JST_SH_6]  43.18,4.57 0 top
H1  TB6612FNG  [SSOP24]  72.72,15.14 90 top
H2  TB6612FNG  [SSOP24]  81.58,26.17 0 top
I2C  JST_SH_4  [JST_SH_4_SMD]  37.59,7.62 0 top
IMU  MPU-9250  [QFN24G-0.4-3X3MM]  29.21,27.3 90 top
J2  STRAWSON_EAGLE_LIB_SERVO_HEADERS_8X  [STRAWSON_EAGLE_LIB_3X8_0.1"_HEADER]  72.26,46.23 0 top
L1  6.8uH  [SRN6045]  47.6,49.47 90 bottom
L2  6.8uH  [SRN6045]  22.53,46.94 90 bottom
L3  3.6 uH  [8X8MM_INDUCTOR]  61.57,48.59 90 bottom
L4  120  [L0603]  16.26,7.62 90 bottom
L5  120  [L0603]  16.38,13.34 90 bottom
LIPO  BATTERY  [JST_XH_3-PIN]  40.54,51.51 0 top
M1  JST_ZH_2  [JST_ZH_2]  83.95,13.72 270 top
M2  JST_ZH_2  [JST_ZH_2]  80.01,13.72 270 top
M3  JST_ZH_2  [JST_ZH_2]  80.01,18.67 270 top
M4  JST_ZH_2  [JST_ZH_2]  83.95,18.67 270 top
MGT1  MOUNTING_HOLE  [MOUNTING_HOLE]  14.61,51.44 0 top
MGT2  MOUNTING_HOLE  [MOUNTING_HOLE]  80.64,48.26 0 top
MGT3  MOUNTING_HOLE  [MOUNTING_HOLE]  80.64,6.35 0 top
MGT4  MOUNTING_HOLE  [MOUNTING_HOLE]  14.61,3.17 0 top
MOD  SWITCH-MOMENTARY-2SMD-1101NE  [TACTILE-SWITCH-1101NE]  27.56,15.24 270 top
ON  BLUE  [BEAGLEBONE_BLUE_LED-0603]  12.57,45.34 0 top
OSC1  NZ2520SB-32.768KHZ-NSA3534C  [NZ2520S]  7.7,22.1 90 top
PAU  SWITCH-MOMENTARY-2SMD-1101NE  [TACTILE-SWITCH-1101NE]  32.64,15.24 270 top
POW  SWITCH-MOMENTARY-2SMD-1101NE  [TACTILE-SWITCH-1101NE]  17.4,15.24 270 top
PROT  S-8261  [SOT-236]  35.01,43.47 270 bottom
PWR  JST_SH_4  [JST_SH_4_SMD]  53.98,12.06 0 top
Q1  MOSFET-N  [SO08-TIGHT]  35.05,48.89 0 bottom
R  RED  [BEAGLEBONE_BLUE_LED-0603]  23.88,5.46 180 top
R1  47k  [0402-RES]  59.89,14.6 90 bottom
R2  1.5K  [0402-RES]  23.67,18.44 270 bottom
R3  1k  [0402-RES]  36.32,48.26 270 top
R4  0.1  [0603-RES]  27.69,50.8 90 bottom
R5  10k  [0402-RES]  19.81,44.96 90 top
R6  10k  [0402-RES]  20.95,44.96 270 top
R7  4.7k  [0402-RES]  23.24,44.96 90 top
R8  10k  [0402-RES]  22.1,44.96 270 top
R9  10K, DNP  [0402-RES]  10.92,42.16 270 top
R10  4.7k  [0402-RES]  26.92,24.46 0 top
R11  4.7k  [0402-RES]  26.92,23.29 180 top
R12  4.7k  [0402-RES]  37.59,7.16 180 bottom
R13  4.7k  [0402-RES]  34.54,7.16 180 bottom
R14  4.7k  [0402-RES]  58.72,14.6 270 bottom
R15  33  [0402-RES]  38.61,35.86 0 bottom
R16  100K  [0402-RES]  63.88,37.85 0 bottom
R17  100K  [0402-RES]  63.88,36.7 0 bottom
R18  1M  [0402-RES]  36.58,24.51 90 top
R19  47k  [0402-RES]  67.94,9.78 0 bottom
R20  1M  [0402-RES]  36.58,29.59 90 top
R21  240  [0402-RES]  24.59,2.79 270 top
R22  240  [0402-RES]  23.55,2.79 270 top
R23  1.5K  [0402-RES]  23.67,20.83 90 bottom
R24  4.7k  [0402-RES]  13.41,43.56 180 bottom
R25  4.7k  [0402-RES]  67.94,10.92 180 bottom
R26  10K  [0402-RES]  3.28,14.86 270 bottom
R27  150  [0402-RES]  31.24,47.37 0 bottom
R28  150  [0402-RES]  27.18,46.74 90 bottom
R29  240  [0402-RES]  33.02,48.26 90 top
R30  240  [0402-RES]  42.04,44.2 270 bottom
R31  240  [0402-RES]  34.54,48.26 90 top
R32  240  [0402-RES]  29.84,48.26 90 top
R33  240  [0402-RES]  31.37,48.26 90 top
R34  150  [0402-RES]  27.18,44.45 270 bottom
R35  10K  [0402-RES]  4.32,14.86 270 bottom
R36  4.7k  [0402-RES]  67.06,27.56 0 top
R37  4.7k  [0402-RES]  67.06,29.84 0 top
R38  4.7k  [0402-RES]  67.06,32.13 0 top
R39  4.7k  [0402-RES]  67.06,34.42 0 top
R40  4.7k  [0402-RES]  67.06,36.7 0 top
R41  4.7k  [0402-RES]  67.06,38.99 0 top
R42  4.7k  [0402-RES]  67.06,41.27 0 top
R43  4.7k  [0402-RES]  67.06,43.56 0 top
R44  1k  [0402-RES]  40.89,44.2 270 bottom
R45  47k  [0402-RES]  54.84,48.72 180 bottom
R46  1K  [0402-RES]  53.77,50.42 270 bottom
R47  100k  [0402-RES]  55.42,46.53 180 bottom
R48  10k  [0402-RES]  55.85,51.56 90 bottom
R49  65k  [0402-RES]  56.9,51.56 270 bottom
R50  4.7k  [0402-RES]  67.06,26.42 0 top
R51  4.7k  [0402-RES]  67.06,28.7 0 top
R52  4.7k  [0402-RES]  67.06,30.99 0 top
R53  4.7k  [0402-RES]  67.06,33.27 0 top
R54  10K  [0402-RES]  9.55,34.14 90 bottom
R55  10K  [0402-RES]  7.9,33.71 180 bottom
R56  10K  [0402-RES]  2.24,14.86 270 bottom
R57  10K  [0402-RES]  7.9,34.75 180 bottom
R58  1.5K  [0402-RES]  20.29,21.54 180 bottom
R59  4.7k  [0402-RES]  50.39,10.77 180 bottom
R60  10K  [0402-RES]  22.3,15.67 180 bottom
R61  1K  [0402-RES]  25.63,2.79 90 top
R62  1K  [0402-RES]  26.67,2.79 90 top
R63  1K  [0402-RES]  27.71,2.79 90 top
R64  1K  [0402-RES]  28.75,2.79 90 top
R65  10K  [0402-RES]  15.88,17.27 270 bottom
R66  10K  [0402-RES]  38.61,34.72 180 bottom
R67  10K  [0402-RES]  28.57,40.51 90 top
R68  10K  [0402-RES]  34.29,40.51 90 top
R69  10K  [0402-RES]  33.15,40.51 90 top
R70  10K  [0402-RES]  32,40.51 90 top
R71  10K  [0402-RES]  36.58,40.51 90 top
R72  10K  [0402-RES]  37.72,40.51 90 top
R73  10K  [0402-RES]  35.43,40.51 90 top
R74  10K  [0402-RES]  30.86,40.51 90 top
R75  10K  [0402-RES]  29.72,40.51 90 top
R76  33  [0402-RES]  39.62,29.57 180 bottom
R77  33  [0402-RES]  67.06,45.85 0 top
R78  33  [0402-RES]  17.91,39.88 270 top
R79  33  [0402-RES]  19.3,39.88 270 top
R80  33  [0402-RES]  16.51,39.88 270 top
R81  33  [0402-RES]  15.11,39.88 270 top
R82  33  [0402-RES]  13.72,39.88 270 top
R83  33  [0402-RES]  12.32,39.88 270 top
R84  33  [0402-RES]  10.92,39.88 270 top
R85  33  [0402-RES]  19.38,25.78 180 top
R86  33  [0402-RES]  19.38,26.82 180 top
R87  100K  [0402-RES]  12.57,20.45 270 top
R88  100K  [0402-RES]  13.61,20.45 270 top
R89  1K, DNP  [0402-RES]  23.39,27.74 0 bottom
R90  1K  [0402-RES]  7.75,20.07 180 top
R91  240  [0402-RES]  21.34,23.77 180 top
R92  33  [0402-RES]  19.38,27.86 180 top
R93  33  [0402-RES]  23.24,36.45 180 top
R94  10K  [0402-RES]  38.61,33.58 180 bottom
R95  100K  [0402-RES]  21.21,6.73 180 bottom
R96  33  [0402-RES]  19.38,28.91 180 top
R97  33  [0402-RES]  19.38,29.95 180 top
R98  10K  [0402-RES]  16.51,42.16 270 top
R99  10K  [0402-RES]  15.11,42.16 270 top
R100  33  [0402-RES]  19.38,30.99 180 top
R101  10K  [0402-RES]  13.72,42.16 270 top
R102  10K  [0402-RES]  12.32,42.16 270 top
R103  10K  [0402-RES]  17.91,42.16 270 top
R104  120, DNP  [0603-RES]  41.81,11.91 90 bottom
R105  10K  [0402-RES]  19.3,42.16 270 top
R106  1.5K  [0402-RES]  23.24,37.59 180 top
R107  .1, 0805  [R0805]  16.15,45.09 90 bottom
R108  1K, DNP  [0402-RES]  23.39,28.88 0 bottom
R109  4.7k  [0402-RES]  57.56,14.6 90 bottom
R110  4.7k  [0402-RES]  56.39,14.6 270 bottom
R111  0  [0402-RES]  56.52,17.53 0 bottom
R112  0  [0603-RES]  7.62,36.93 0 bottom
R113  100K  [0402-RES]  63.88,29.84 0 bottom
R115  100K  [0402-RES]  63.88,30.99 0 bottom
R116  100K  [0402-RES]  67.06,44.7 0 top
R118  100K  [0402-RES]  63.88,28.7 180 bottom
R119  0, DNP  [0603-RES]  22.58,12.95 180 bottom
R120  100K  [0402-RES]  67.06,40.13 0 top
R121  0, DNP  [0603-RES]  17.91,10.34 270 bottom
R122  100K  [0402-RES]  67.06,42.42 0 top
R123  33  [0402-RES]  19.38,32.03 180 top
R124  33  [0402-RES]  19.38,33.07 180 top
R125  100K  [0402-RES]  67.06,35.56 180 top
R127  100K  [0402-RES]  67.06,37.85 180 top
R129  100K  [0402-RES]  63.88,35.56 0 bottom
R131  100K  [0402-RES]  63.88,32.13 0 bottom
R135  100K  [0402-RES]  63.88,34.42 0 bottom
R140  100K  [0402-RES]  63.88,33.27 180 bottom
R143  100K  [0402-RES]  56.03,41.71 90 bottom
R149  0  [0402-RES]  8.15,41.63 180 top
R150  0  [0402-RES]  38.61,32.51 0 bottom
R156  33  [0402-RES]  19.33,13.06 270 bottom
R158  10K  [0402-RES]  59.05,19.18 90 bottom
RST  SWITCH-MOMENTARY-2SMD-1101NE  [TACTILE-SWITCH-1101NE]  22.48,15.24 270 top
S1.1  JST_SH_6  [JST_SH_6]  53.34,4.57 0 top
S1.2  JST_SH_6  [JST_SH_6]  53.34,8.89 0 top
SD  SWITCH-MOMENTARY-2SMD-1101NE  [TACTILE-SWITCH-1101NE]  71.98,51.82 180 top
SIP  OSD3358  [BEAGLEBONE_BLUE_OSD3358]  51.82,28.96 90 top
TCK  TPSQB1,27  [B1,27]  48.64,13.46 0 bottom
TDI  TPSQB1,27  [B1,27]  50.42,13.46 0 bottom
TDO  TPSQB1,27  [B1,27]  49.53,11.94 0 bottom
TMS  TPSQB1,27  [B1,27]  51.31,11.94 0 bottom
TP1  TPSQB1,27  [B1,27]  58.93,42.06 180 bottom
TP5  TPB0,65  [BEAGLEBONE_BLUE_B0,65]  49.5,22.28 0 bottom
TP12  TPSQB1,27  [B1,27]  70.51,2.64 0 bottom
TRSTN  TPSQB1,27  [B1,27]  52.2,13.46 0 bottom
U1  TCAN1051HV  [BEAGLEBONE_BLUE_D8]  37.24,11.68 180 bottom
U2  SN74LV1T126DBVR  [BEAGLEBONE_BLUE_SOT23-5]  23.34,40.59 0 top
U3  TPD4S012DRY  [SON-6(TI)-DRY]  8.03,40.34 0 top
U4  TPD4S012DRY  [SON-6(TI)-DRY]  3.94,9.02 90 bottom
U5  24LC_32AT-I/OT  [SOT95P290X145-5N]  20.94,19.63 0 bottom
U6  SN74LVC1G07_DCK_5  [BEAGLEBONE_BLUE_DCK5]  37.21,12.75 0 top
U7  WL1835MODGBMOCT  [MOC-100(TI)]  11.33,30.86 180 top
U8  TPS2105_DBV_5  [DBV5]  20.7,9.91 90 bottom
U9  TXS0108ERGYR  [R-PVQFN-N20(TI)]  21.84,35.56 90 bottom
U10  TXS0108ERGYR  [R-PVQFN-N20(TI)]  23.24,29.24 270 top
U13  EMMC  [MICRON_EMMC_153]  31.62,34.44 0 bottom
U$2  [BATTERY_INDICATOR_LEFT]  32.26,45.21 0 top
U$5  [XYZ_BIG]  32.23,31.29 90 top
UT0  JST_SH_4  [JST_SH_4_SMD]  66.42,3.3 0 top
UT1  JST_SH_4  [JST_SH_4_SMD]  66.42,7.62 0 top
UT5  JST_SH_4  [JST_SH_4_SMD]  74.55,7.62 0 top
WIFI  GREEN  [BEAGLEBONE_BLUE_LED-0603]  22.83,22.73 90 top
WP  GHI2_TESTPAD/W_HOLE_1X1  [GHI2_TESTPAD/W_HOLE_1X1]  25.02,17.14 0 bottom
X2  SCHA5B0200  [SCHA5B0200]  1.4,25.02 90 bottom
X3  USB1  [USB_HOST_HORIZONTAL_W/CHASSIS_GND]  -2.54,9.02 270 top
X4  10118192-0001LF  [10118192-0001LF(MICRO-USB-B-AMPHENOL-FCI)]  1.45,38.35 90 bottom
Y1  24 MHz  [CRYSTAL_5X3.2MM]  34.16,29.59 90 top
Y2  32.768kHz  [CRYSTAL_3.2X1.5]  34.54,24.51 90 top

## Tracks (layer width: path | path; a pad name or v marks a point on that pad's centre or on a via)
3.3V  (via drill 0.25 pad 0.46, 0.5, 0.81 pad 0.41)
  Top 0.152: R10.1 v25.65,24.46 | C37.1 68.1,19.58 v68.76,19.58 | IMU.22 27.28,27.11 26.87,26.7 26.87,25.7 26.72,25.55 C8.1 | IMU.1 28.21,25.39 v27.96,25.15 | IMU.8 31.11,26.7 31.24,26.57 31.24,25.81 30.91,25.48 v30.91,25.15 | IMU.13 30.21,29.2 30.07,29.34 29.92,29.34 29.77,29.49 C9.2 | IMU.13 30.23,28.83 | IMU.13 31.77,28.8 32.54,28.04 32.54,26.01 v32.79,25.76 | R11.2 25.35,23.29 24.38,24.26 v24.38,24.89
  Top 0.254: CAN.2 45.18,12.43 45.52,12.09 v46.13,12.09 | 52.45,13.32 PWR.3 52.44,12.28 v52.78,11.94 | U10.19 v24.97,31.57 | C35.2 22.58,25.86 v22.2,25.48 | C56.1 v21.18,24.82 | v28.07,42.29 27.43,41.66 C39.1 R67.2 R75.2 R74.2 R70.2 R69.2 R68.2 R73.2 R71.2 R72.2 37.72,41.73 37.34,42.11 v36.73,42.11 | R122.2 68.25,42.42 68.56,42.72 v68.56,42.98 68.56,42.77 | R116.2 68.1,44.7 68.48,45.09 v68.48,45.87 | R120.2 68.12,40.13 68.5,40.51 v68.5,40.79 | S1.1.2 57.35,4.59 57.33,4.61 v57.33,7.7 57.33,8.88 S1.2.2 | v47.17,7.7 v47.18,7.71 GP0.2 | C13.1 30.96,24.43 30.75,24.65 BMP.8 30.41,24.2 v30.63,23.98 | C8.1 v25.45,25.55 | BMP.6 29.11,24.12 v29.26,23.98 29.26,23.88 29.76,23.37 BMP.2 | E3.2 E4.2 v83.11,42.39 | GP1.2 37.05,4.6 37.03,4.62 v37.03,6.15 37.03,8.87 I2C.2 | E2.2 v80.24,35.41 81.91,35.41 E1.2 | UT5.2 v74.02,6.98 | UT1.2 v65.89,7.7 | UT0.2 v65.89,5.77
  Top 0.406: C38.1 44.35,45.99 v44.35,44.83 | H1.20 v70.61,14.16 v70.61,14.17 | 15.24,21.77 v15.24,20.32 | H2.20 80.61,28.95 80.24,28.57 v79.78,28.57
  Bottom 0.152: R56.2 v2.23,13.54 | R26.2 v3.28,13.54 | U13.J10 30.85,33.69 v31.09,33.93 30.87,33.72 U13.K9 | U13.F5 32.37,35.19 | 32.37,35.19 U13.E6 32.61,35.93 v32.61,36.2 32.61,36.45 U13.C6 | 32.37,35.19 v32.16,34.98 | U13.P5 U13.N4 | U13.P3 U13.N4 | U13.N4 U13.M4 33.37,32.9 v33.35,32.92 | R140.2 v65.15,33.27 | R118.2 v65.15,28.7 | R109.1 57.56,14.45 57.71,14.6 v58.14,14.6 | v59.44,20.45 59.66,20.22 59.66,19.76 59.82,19.61 C41.1 | C27.1 v32.21,8.05 | C40.1 v48.9,8.43
  Bottom 0.254: C2.2 v76.2,21.01 | X2.4 2.66,16.89 v2.16,16.38 | R35.2 v4.32,13.54 | R65.2 v15.88,16 | R23.2 23.57,21.49 v22.45,21.49 | R58.2 20.9,21.49 v21.69,21.49 | 8.51,34.7 R54.2 10.19,34.7 10.46,34.42 10.46,33.2 10.29,33.02 9.93,33.02 8.13,31.22 8.13,29.82 6.86,28.55 6.86,22.45 8.81,20.5 9.75,20.5 13.59,24.33 18.47,24.33 v18.8,24.66 | R57.2 R55.2 | C34.2 v10.92,16.38 | C51.2 23.93,30.53 v24.97,31.57 | R66.2 R94.2 39.17,33.17 39.04,33.05 36.98,33.05 v36.8,33.22 | C49.2 38.91,38.86 38.73,38.68 v38.73,37.85 | C16.1 51.59,7.2 v51.59,8.2 | U9.19 24.26,33.81 v24.41,33.66 | U5.4 19.63,18.71 v19.63,19.38 | C28.1 19.86,17.7 v19.18,17.7 | R2.2 23.7,17.86 24.08,17.86 24.46,18.24 v24.46,18.52 | R60.2 23.32,15.67 v23.67,15.32 | U1.5 41.02,13.59 v41.2,13.77 | R13.1 v33.98,7.98 | R12.2 38.15,7.67 38.46,7.98 v38.84,7.98
  Bottom 0.305: 8.51,34.7 R57.2
  pour Route2 (rank 6): -2.54,57.15 88.9,57.15 88.9,-2.54 -2.54,-2.54
  pour Top: 38.86,36.58 40.13,36.58 40.39,36.83 40.39,37.21 39.75,37.21 39.75,38.48 40.39,38.48 40.39,38.86 40.13,39.12 38.86,39.12 37.97,38.23 37.97,37.47
  pour Top (no thermals): 14.61,24.89 15.75,24.89 15.75,21.08 14.61,21.08
5.0V  (via drill 0.25 pad 0.46, 0.5, 0.6)
  Top 0.254: GPS.5 v44.17,3 | PWR.4 51.44,9.09 50.7,8.36 v50.7,3
  Top 0.406: 5VREG.3 50.29,47.62 49.25,47.62 46.91,49.96 46.91,51.97 46.35,52.53 v46.35,53.42
  Route2 0.61: v77.09,9.88 78.16,10.95 78.16,15.49 79.38,16.71 80.47,16.71 81.56,17.8 81.56,32.97 82.5,33.91 83.59,33.91 v83.62,33.93
  Bottom 0.152: 46.35,51.9 47.12,51.9 L1.2 | U8.5 U8.1 21.65,6.85 R95.2
  Bottom 0.406: 46.35,51.9 v46.35,53.42
  Bottom 0.61: v77.09,9.88 75.92,8.71 72.9,8.71 67.18,3 v50.7,3 v44.17,3 23.67,3 22.55,4.12 22.55,10.41 C63.1 | v58.12,43.33 65.81,43.33 66.55,44.07 66.55,46.2 68.56,48.21 75.64,48.21 83.8,40.06 83.8,34.11 v83.62,33.93
  pour Top (isolate 0.152, no thermals): 57.02,40.64 59.31,40.64 59.31,43.94 52.83,43.94 52.83,45.59 50.8,45.59 50.8,47.75 49.78,47.75 49.78,45.03 52.07,45.03 52.07,43.43 57.02,43.43
  pour Bottom (rank 2, no thermals): 22.73,13.72 24.13,13.72 24.13,10.16 21.08,10.16 21.08,11.94 22.73,11.94
32.768KHZ
  Top 0.254: U7.36 7.83,24.08 7.52,23.77 7.26,23.77 7.07,23.58 OSC1.3
AIN0
  Top 0.152: SIP.B6 58.32,17.37 58.32,16.66 58.67,16.31 59.59,16.31 61.37,14.53 61.65,14.53 61.92,14.25 62.48,14.25 62.69,14.04 ADC.3
AIN1
  Top 0.152: SIP.C7 56.44,19.25 56.44,18.97 57.05,18.36 57.05,17.93 57.33,17.65 57.53,17.65 58.01,17.17 58.01,16.51 58.52,16 59.46,16 61.24,14.22 61.52,14.22 61.69,14.05 ADC.4
AIN2
  Top 0.152: ADC.5 60.69,14.34 59.33,15.7 57.05,15.7 56.74,16 56.74,17.17 56.26,17.65 SIP.B7
AIN3
  Top 0.152: SIP.A7 56.26,15.82 56.69,15.39 59.21,15.39 59.79,14.81 59.79,14.33 59.69,14.22 ADC.6
ALT.BUFF.OE  (via drill 0.25 pad 0.46)
  Top 0.152: v22.66,40.31 22.39,40.05 U2.1 22.39,38.41 22.68,38.12 R106.2 R93.2 22.68,34.67 22.38,34.37 22.38,32.72 22.61,32.49 v22.94,32.49 | U10.10 22.38,26.9 v21.74,26.9
  Bottom 0.152: U9.10 21.09,38.75 v22.66,40.31 | v21.74,26.9 21.74,30.33 22.43,31.01 22.43,31.98 v22.94,32.49
ANT1_A
  Top 0.406: U7.32 4.62,25.96 arc90 3.94,25.27 C48.2
ANT1_B
  Top 0.406: ANT1.SIG C48.1
ANT2_A
  Top 0.406: U7.18 4.62,35.76 arc-90 3.94,36.45 C58.2
ANT2_B
  Top 0.406: ANT2.SIG C58.1
BATT_LED_1  (via drill 0.25 pad 0.46)
  Top 0.152: B0.A 34.54,43.94 34.67,43.81 41.02,43.81 42.34,45.14 v42.72,45.14 | 50.32,36.37 v50.55,36.37 50.22,36.37 49.91,36.68 SIP.U12
  Bottom 0.152: v42.72,45.14 43.16,45.14 43.41,44.88 43.41,44.42 43.94,43.89 47.3,43.89 47.83,44.42 49.81,44.42 50.37,44.98 52.68,44.98 53.8,43.87 55.42,43.87 56.84,42.44 56.84,41.33 58.85,39.32 58.85,38.1 56.24,35.48 51.74,35.48 50.85,36.37 v50.55,36.37
BATT_LED_2  (via drill 0.25 pad 0.46)
  Top 0.152: B1.A 33.02,43.94 33.45,43.51 41.4,43.51 42.37,44.48 v42.72,44.48 | SIP.T5 58.32,36.42 58.32,39.06 v58.37,39.12
  Bottom 0.152: 58.37,39.24 v58.37,39.12 | 58.37,39.09 v58.37,39.12 | v58.37,39.12 58.37,39.32 56.54,41.15 56.54,41.55 56.39,41.71 56.16,41.71 56.03,41.83 R143.2 56.03,42.77 55.24,43.56 53.67,43.56 52.55,44.68 50.49,44.68 49.94,44.12 47.95,44.12 47.42,43.59 43.81,43.59 42.93,44.48 v42.72,44.48
BATT_LED_3  (via drill 0.25 pad 0.46)
  Top 0.152: B2.A 31.37,43.89 32.05,43.2 41.76,43.2 42.37,43.81 v42.72,43.81 | SIP.V6 57.53,38.94 v57.71,39.12
  Bottom 0.152: v57.71,39.12 57.71,39.24 57,39.95 56.03,39.95 55.55,40.44 55.55,42.49 54.79,43.26 53.54,43.26 52.43,44.37 50.62,44.37 50.06,43.81 48.08,43.81 47.55,43.28 43.69,43.28 43.16,43.81 v42.72,43.81
BATT_LED_4  (via drill 0.25 pad 0.46)
  Top 0.152: B3.A 29.84,43.89 30.84,42.9 42.47,42.9 v42.72,43.16 | SIP.T11 51.18,36.52 50.67,37.03 v50.55,37.03
  Bottom 0.152: v42.72,43.16 42.9,42.98 47.7,42.98 48.23,43.51 50.19,43.51 50.75,44.07 52.3,44.07 53.42,42.95 54.66,42.95 55.24,42.37 55.24,40.31 55.91,39.65 56.64,39.65 57.05,39.24 57.05,38.84 57.38,38.51 57.38,37.08 56.08,35.79 51.92,35.79 50.67,37.03 v50.55,37.03
BATT_MID
  Bottom 0.406: R44.1 R30.1 42.04,47.47 LIPO.P$2 38.94,47.37 R27.1
BATT_MINUS
  Bottom 0.254: BAL.6 BAL.5 | C1.2 C18.1 30.84,41.66 BAL.5 | PROT.6 34.07,43.09 | 34.07,43.09 35.01,44.03 PROT.2 35.01,45.12 34.8,45.34 34.67,45.34 34.42,45.59 Q1.3 | BAL.5 31.88,42.8 32.26,43.18 C19.2 33.27,43.89 34.07,43.09 | 37.09,46.1 37.08,46.09 Q1.1
  Bottom 0.406: C15.1 39.75,45.64 LIPO.P$3 38.94,46.43 38.61,46.1 37.09,46.1 | Q1.3 Q1.2 Q1.1
BT_AUD_CLK
  Top 0.152: U10.1 22.49,31.99 22.4,32.08 20.8,32.08 20.52,32.36 20.52,32.92 20.37,33.07 R124.1
BT_AUD_FSYNC
  Top 0.152: R123.1 20.37,32.03 20.78,31.62 20.78,30.68 20.98,30.48 U10.3
BT_AUD_IN
  Top 0.152: R97.1 20.37,29.95 20.83,29.48 U10.5
BT_AUD_OUT
  Top 0.152: R100.1 20.32,30.99 20.47,30.84 20.47,30.3 20.79,29.98 U10.4
BT_EN  (via drill 0.25 pad 0.46)
  Top 0.152: SIP.K17 43.03,28.32 42.82,28.52 v42.82,28.96 | v26.72,35.31 25.93,35.31 24.94,34.31 v24.46,34.31
  Route2 0.152: v42.82,28.96 42.32,29.46 40.49,29.46 39.14,30.81 31.67,30.81 29.26,33.22 29.26,34.87 28.85,35.28 26.75,35.28 v26.72,35.31
  Bottom 0.152: v24.46,34.31 v24.45,34.31 U9.18
BT_EN_1V8  (via drill 0.25 pad 0.46)
  Top 0.152: v11.94,25.35 11.66,25.35 11.33,25.02 U7.41 11.33,24.11 11.48,23.95 11.96,23.95 13.61,22.3 R88.1
  Bottom 0.152: v11.94,25.35 11.94,26.09 12.19,26.34 16.64,26.34 17.32,27.03 17.32,34.09 18.09,34.85 18.87,34.85 19.41,34.31 U9.3
BT_HCI_CTS
  Top 0.152: R86.1 20.37,26.82 20.5,26.95 20.5,27.56 20.92,27.98 U10.8
BT_HCI_RTS
  Top 0.152: R85.1 20.34,25.78 20.8,26.24 20.8,27.3 20.98,27.48 U10.9
BT_HCI_RX
  Top 0.152: R96.1 20.02,28.98 U10.6
BT_HCI_TX
  Top 0.152: R92.1 20.32,27.86 20.94,28.48 U10.7
CANH  (via drill 0.25 pad 0.46)
  Top 0.152: v44.15,12.14 44.15,13.3 CAN.3
  Bottom 0.152: v44.15,12.14 43.07,11.06 R104.1 39.71,11.06 U1.7
CANL  (via drill 0.25 pad 0.46)
  Top 0.152: v43.2,12.14 43.2,13.31 CAN.4
  Bottom 0.152: v43.2,12.14 42.58,12.76 R104.2 41.24,12.76 40.79,12.32 U1.6
CGND
  Bottom 0.305: X2.CGND5 14.19,27.59 13.21,28.57 13.21,31.62 12.56,32.27 11.84,32.27 | 11.84,32.27 X2.CGND4 11.15,32.32 11.24,32.32 11.3,32.26 | X3.5 9.92,17.77 X2.CGND1 12.4,19.89 14.1,21.59 X2.CGND6 | 4.01,35.25 X4.CGND6 4.04,35.3 4.04,35.31 11.73,35.31 12.01,35.03 12.01,33.1 11.81,32.89 11.81,32.34 11.86,32.29 11.84,32.27
  pour Bottom (rank 6): -3.81,58.42 -3.81,26.67 1.65,26.67 1.65,30.86 2.03,31.24 2.03,32.89 2.79,33.78 4.7,33.78 4.7,36.2 2.92,36.2 2.92,40.51 4.7,40.51 4.7,42.55 2.54,44.7 2.54,51.05 4.45,52.96 11.18,52.96 11.81,52.32 11.81,49.66 14.86,46.99 14.86,45.34 17.4,45.34 17.4,47.12 16.51,47.12 16.51,48.89 17.4,50.04 17.4,53.34 74.68,52.96 76.45,51.18 76.45,48.01 79.38,45.09 82.42,45.09 84.71,42.8 84.71,26.67 90.17,26.67 90.17,58.42
  pour Bottom (rank 6): -3.81,26.67 -3.81,-3.81 90.17,-3.81 90.17,26.67 84.71,26.67 84.71,22.48 82.55,20.32 82.55,12.45 76.83,6.73 76.83,3.3 75.18,1.65 19.18,1.65 17.91,2.92 17.91,4.19 16.26,5.84 13.34,5.84 11.18,3.68 9.78,3.68 7.37,6.1 3.05,6.1 2.41,6.73 2.41,11.05 3.3,11.94 6.99,11.94 9.65,14.6 9.65,16.38 8.64,17.4 6.6,17.4 5.08,15.62 5.08,13.21 4.83,12.95 1.91,12.95 1.65,13.21 1.65,16.76 2.03,17.14 2.03,18.41 1.65,18.8 1.65,26.67
  pour Top (rank 6): -3.81,58.42 -3.81,26.67 1.65,26.67 1.65,49.78 4.83,52.96 11.68,52.96 12.32,52.32 12.32,49.78 13.34,48.77 15.88,48.77 17.27,50.16 17.27,52.96 73.91,52.96 77.47,49.4 77.47,47.37 79.5,45.34 84.33,45.34 84.96,44.7 84.96,26.67 90.17,26.67 90.17,58.42
  pour Top (rank 6): -3.81,26.67 -3.81,-3.81 90.17,-3.81 90.17,26.67 84.96,26.67 85.09,11.94 82.8,9.02 79.5,9.02 77.85,7.37 77.85,4.7 74.8,1.65 17.4,1.65 17.4,4.19 16,5.97 13.34,5.97 11.68,4.32 9.53,4.32 6.6,7.24 6.6,11.81 9.78,14.99 9.78,16.26 8.51,17.53 1.65,17.53 1.65,26.67
CHG_EN
  Top 0.152: 22.12,45.54 R8.1
  Top 0.254: CHGIC.6 22.12,45.54 | R8.1 R7.2
CO  (via drill 0.25 pad 0.46)
  Top 0.254: R7.1 27.61,44.4 v28.07,43.94
  Bottom 0.254: v28.07,43.94 28.07,43.05 28.32,42.8 BAL.8
DCAN1_RX  (via drill 0.25 pad 0.46)
  Top 0.152: 45.06,14.91 v45.06,14.53 45.06,15.11 45.44,15.49 45.44,16.41 45.31,16.53 45.31,19.76 45.16,19.91 44.78,19.91 44.35,20.34 44.35,21.56 43.94,21.97 SIP.E17 | v41,8.69 38.73,10.95 v37.47,10.95
  Bottom 0.152: v45.06,14.53 45.59,13.99 45.59,7.44 45.06,6.91 44.12,6.91 43.54,7.49 43.54,8.33 43,8.87 41.17,8.87 v41,8.69 | v37.47,10.95 36.52,11.89 36.52,13.26 36.2,13.59 U1.4
DCAN1_SILENT  (via drill 0.25 pad 0.46)
  Top 0.152: SIP.M16 45.34,30.86 45.82,30.38 47.3,30.38 48.16,29.52 48.16,29.39 48.44,29.11 48.62,29.11 49.43,28.3 49.43,26.95 48.74,26.26 48.44,26.26 48.16,25.98 48.16,24.23 48.36,24.03 48.67,24.03 v49.28,23.42 | v39.73,16.2 39.73,15.57 v38.25,14.1
  Bottom 0.152: v49.28,23.42 49.28,22.96 48.74,22.43 45.9,22.43 45.34,21.87 45.34,18.59 45.62,18.31 46.97,18.31 47.4,17.88 47.4,16.89 46.99,16.48 46.53,16.48 45.82,17.2 40.72,17.2 v39.73,16.2 | v38.25,14.1 38.25,10.03 38.51,9.78 U1.8
DCAN1_TX  (via drill 0.25 pad 0.46)
  Top 0.152: v43.08,14.53 43.08,21.18 SIP.E18
  Bottom 0.152: v43.08,14.53 43.08,14.25 44.68,12.65 44.68,9.73 44.12,9.17 37.16,9.17 36.55,9.78 U1.1
DO
  Bottom 0.254: PROT.1 34.04,44.7 33.53,44.7 33.15,45.09 Q1.4
EMMC_RST  (via drill 0.25 pad 0.46)
  Top 0.152: SIP.R14 46.63,33.93 46.63,33.05 46.35,32.77 v45.92,32.77
  Bottom 0.152: U13.K5 33.39,33.71 37.39,33.71 37.52,33.58 R94.1 38.48,33.58 38.61,33.71 38.61,35.05 38.84,35.28 39.47,35.28 41.1,36.91 42.72,36.91 43.87,35.76 44.2,35.76 44.78,35.18 45.19,35.18 45.31,35.05 45.31,34.44 45.74,34.01 45.74,32.94 v45.92,32.77
EQEP_0A  (via drill 0.25 pad 0.46)
  Top 0.152: v56.9,22.15 57.2,22.45 66.04,22.45 66.75,23.16 66.75,24.66 68.02,25.93 68.68,25.93 69.34,26.59 v69.34,27.28 | SIP.B12 49.43,18.64 49.43,20.95 49.66,21.18 51.44,21.18 51.66,20.95 51.66,20.34 52.09,19.91 52.65,19.91 52.96,19.61 v53.09,19.61 | v79.45,34.06 79.79,34.4 E1.3
  Bottom 0.152: v56.9,22.15 56.57,21.82 54.59,21.82 54.33,21.56 54.33,20.5 54.43,20.4 54.43,19.81 54.1,19.48 53.21,19.48 v53.09,19.61 | v69.34,27.28 69.52,27.46 70.61,27.46 70.87,27.71 70.87,29.23 71.63,30 72.67,30 73.25,30.58 73.25,31.9 73.86,32.51 75.69,32.51 77.24,34.06 v79.45,34.06
EQEP_0B  (via drill 0.25 pad 0.46)
  Top 0.152: v66.42,25.07 66.42,23.29 65.89,22.76 56.82,22.76 v56.77,22.81 | v53.9,20.07 53.49,20.07 53.34,20.22 52.25,20.22 51.97,20.5 51.97,21.18 51.66,21.49 49.48,21.49 49.12,21.13 49.12,19.91 SIP.C13 | v79.45,33.4 E1.4
  Bottom 0.152: v66.42,25.07 66.42,25.86 66.9,26.34 69.09,26.34 69.9,27.15 70.74,27.15 71.22,27.63 71.22,29.06 71.86,29.69 72.8,29.69 73.56,30.45 73.56,31.77 73.99,32.21 75.87,32.21 77.06,33.4 v79.45,33.4 | v56.77,22.81 56.08,22.12 54.46,22.12 54.03,21.69 54.03,20.19 v53.9,20.07
EQEP_1A  (via drill 0.25 pad 0.46)
  Top 0.152: SIP.V2 63.02,38.48 v63.25,38.71 | E2.3 77,34.4 76.78,34.62 76.78,38.73 75.64,39.88 v74.78,39.88
  Bottom 0.152: v63.25,38.71 63.25,37.92 R16.2 63.8,37.85 63.88,37.92 63.88,38.23 64.16,38.51 66.57,38.51 67.67,39.6 74.5,39.6 v74.78,39.88
EQEP_1B  (via drill 0.25 pad 0.46)
  Top 0.152: SIP.V3 61.65,38.18 v62.03,38.18 | E2.4 76.94,33.4 76.48,33.86 76.48,36.4 75.82,37.06 74.5,37.06 v74.02,37.54
  Bottom 0.152: v62.03,38.18 62.38,38.18 62.79,37.77 62.79,37.47 62.99,37.26 63.17,37.26 63.32,37.11 R17.2 63.68,36.7 63.88,36.91 63.88,37.08 64.06,37.26 66.27,37.26 66.37,37.36 73.84,37.36 v74.02,37.54
EQEP_2A  (via drill 0.25 pad 0.46)
  Top 0.152: SIP.T12 50.32,35.94 v50.55,35.71 | E3.3 77.83,41.4 76.71,41.4 76.53,41.58 76.53,44.48 75.87,45.14 73.97,45.14 v73.79,45.31
  Bottom 0.152: v50.55,35.71 50.9,35.71 51.44,35.18 56.36,35.18 59.99,38.81 59.99,40.36 60.96,41.33 65.73,41.33 67.84,43.43 67.84,44.48 68.5,45.14 73.61,45.14 v73.79,45.31
EQEP_2B  (via drill 0.25 pad 0.46)
  Top 0.152: SIP.R12 50.34,34.67 50.55,34.87 v50.55,35.05 | E3.4 76.76,40.39 76.05,41.1 76.05,44.22 75.49,44.78 73.99,44.78 v73.81,44.6
  Bottom 0.152: v50.55,35.05 51.1,35.05 51.28,34.87 56.49,34.87 60.3,38.68 60.3,40.23 61.09,41.02 65.86,41.02 68.15,43.31 68.15,44.3 68.63,44.78 73.64,44.78 v73.81,44.6
GND  (via drill 0.25 pad 0.46, 0.41, 0.5)
  Top 0.152: U10.11 | C37.2 68.54,20.71 v68.76,20.5 | IMU.20 27.32,27.91 27.18,27.76 27.18,27.43 26.95,27.2 26.54,27.2 26.39,27.05 C8.2 | IMU.9 31.19,27.11 31.34,26.95 31.6,26.95 31.73,26.82 C6.2 31.73,25.68 31.62,25.58 v31.62,25.15 | IMU.18 28.21,29.2 28.35,29.34 28.5,29.34 28.65,29.49 C9.1 | IMU.18 28.18,28.83 | v27.76,29.39 27.76,29.03 27.99,28.8 IMU.18
  Top 0.254: H2.3 | H2.4 | H2.10 83.84,22.52 | PWR.1 54.44,12.27 v54.1,11.94 | PWR.2 v53.44,11.94 | CAN.1 46.13,13.28 46.13,14.27 v45.87,14.53 | R6.1 20.95,46.23 v20.45,46.74 | CHGIC.8 23.75,47.07 v24,46.81 | C10.1 25.45,52.53 v25.15,52.83 | R32.2 R33.2 R29.2 R31.2 35.13,48.82 35.43,48.51 v35.43,47.98 | 5VREG.8 v47.75,53.42 | 5VREG.7 v49.02,53.42 | 5VREG.6 v50.29,53.42 | 5VREG.5 v51.56,53.39 | R127.1 v68.33,37.85 | R52.2 v68.33,30.99 | R51.2 v68.33,28.7 | R53.2 v68.33,33.27 | U10.11 v23.44,27 | R8.2 22.1,43.94 22.35,43.69 v26.16,43.69 | U2.3 v24.28,40.39 | R106.1 23.8,37.92 v24.13,38.25 | C50.2 23.37,33.4 23.57,33.2 23.57,32.18 v23.24,31.85 | U10.TP v23.24,31.17 | C35.1 23.99,25.97 U10.11 | R125.1 68.05,35.56 68.33,35.84 v68.33,36.07 | v48.18,7.7 GP0.1 | GPS.2 47.17,4.58 v47.17,6.76 | S1.1.1 v58.34,7.7 S1.2.1 | R50.2 68.17,26.42 v68.58,26.82 | SIP.A18 42.29,15.14 v41.68,14.53 | GPS.6 43.18,5.87 v42.9,6.15 | BMP.1 30.7,23.05 30.96,23.32 C13.2 31.7,23.32 32.03,23.65 v32.03,23.98 | C8.2 25.78,26.67 v25.45,26.34 | BMP.5 28.46,24.93 28.73,25.2 29.52,25.2 29.76,24.95 BMP.7 29.76,24.26 29.92,24.11 v29.92,23.98 | C36.2 36.04,34.04 35.89,33.88 v35.89,33.22 | C39.2 v27.43,39.09 | C4.1 17.6,44.4 v17.48,44.27 | 6VREG.3 55.82,46.5 55.65,46.33 55.65,45.8 55.5,45.64 v55.5,45.49 | C7.2 16.02,44.93 v17.45,44.93 | 14.09,45.34 C12.2 13.55,45.07 v13.28,45.34 | C56.2 23.47,24.82 v23.82,24.46 | E3.1 E4.1 v83.11,43.38 | SD.1 75.13,50.39 v75.77,49.76 | E2.1 v80.24,36.4 E1.1 | GP1.1 38.05,4.6 38,4.66 v38,6.15 38,8.84 I2C.1 | UT5.1 v75.01,6.96 | SIP.V1 63.88,38.99 63.12,39.75 SIP.W2 | UT1.1 v66.88,7.7 | UT0.1 v66.88,5.77 | ADC.1 65.46,13.21 v65.71,12.95 | SIP.A1 64.19,17.2 v64.19,17.48
  Top 0.254: POW.1 v17.4,16.81 | MOD.1 v26.34,18.39 | v26.34,18.39 | RST.1 21.84,19.02 v20.7,19.02 | U6.3 36.19,12.12 v37.21,12.12 | PAU.1 31.6,18.39 31.37,18.16 v31.37,16 | H2.9